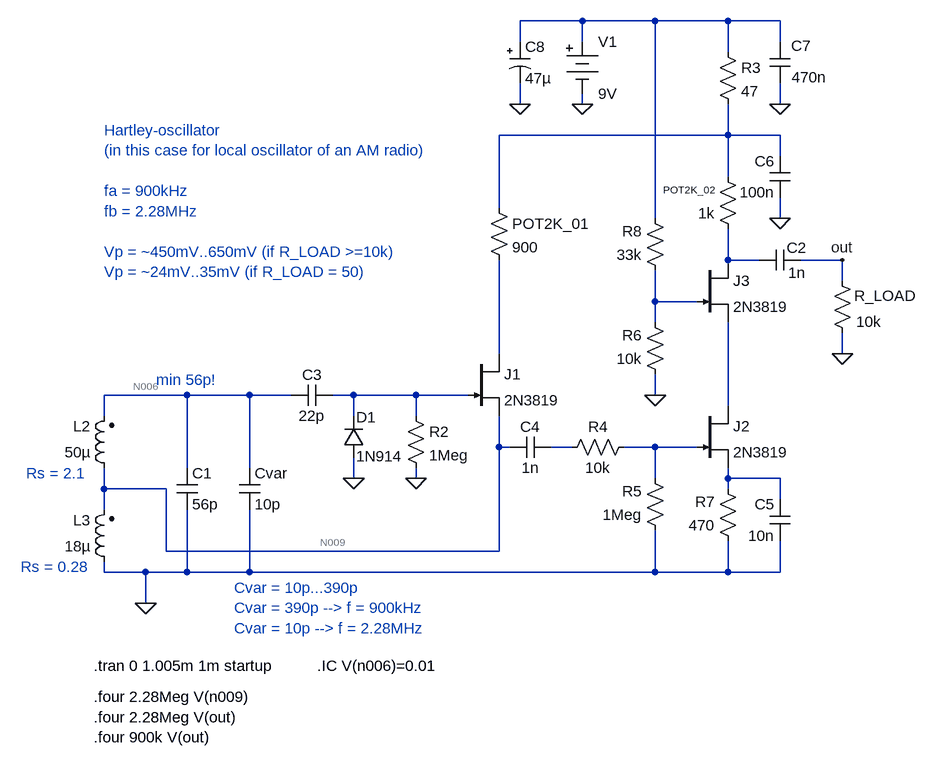
[diagram p0: schematic hartley-oscillator.asc]
hartley-oscillator.asc, the LTspice schematic file:
Version 4.1
SHEET 1 3080 944
WIRE 304 -224 208 -224
WIRE 416 -224 304 -224
WIRE 528 -224 416 -224
WIRE 608 -224 528 -224
WIRE 208 -192 208 -224
WIRE 304 -192 304 -224
WIRE 608 -192 608 -224
WIRE 528 -176 528 -224
WIRE 208 -96 208 -128
WIRE 304 -96 304 -112
WIRE 608 -96 608 -128
WIRE 528 -48 528 -96
WIRE 528 -48 176 -48
WIRE 608 -48 528 -48
WIRE 608 -16 608 -48
WIRE 528 16 528 -48
WIRE 176 64 176 -48
WIRE 416 80 416 -224
WIRE 608 80 608 48
WIRE 528 144 528 96
WIRE 576 144 528 144
WIRE 704 144 640 144
WIRE 704 176 704 144
WIRE 416 208 416 160
WIRE 480 208 416 208
WIRE 416 240 416 208
WIRE 176 288 176 144
WIRE 704 288 704 256
WIRE -304 352 -432 352
WIRE -208 352 -304 352
WIRE -144 352 -208 352
WIRE -48 352 -80 352
WIRE 48 352 -48 352
WIRE 128 352 48 352
WIRE 416 352 416 320
WIRE 528 368 528 240
WIRE -432 384 -432 352
WIRE -48 384 -48 352
WIRE 48 384 48 352
WIRE 176 432 176 384
WIRE 192 432 176 432
WIRE 288 432 256 432
WIRE 416 432 368 432
WIRE 480 432 416 432
WIRE -304 464 -304 352
WIRE -208 464 -208 352
WIRE -48 480 -48 448
WIRE 48 480 48 464
WIRE 416 480 416 432
WIRE 528 480 528 464
WIRE 608 480 528 480
WIRE -432 496 -432 464
WIRE -336 496 -432 496
WIRE 528 496 528 480
WIRE 608 512 608 480
WIRE -432 528 -432 496
WIRE -336 592 -336 496
WIRE 176 592 176 432
WIRE 176 592 -336 592
WIRE -432 624 -432 608
WIRE -368 624 -432 624
WIRE -304 624 -304 528
WIRE -304 624 -368 624
WIRE -208 624 -208 528
WIRE -208 624 -304 624
WIRE 416 624 416 560
WIRE 416 624 -208 624
WIRE 528 624 528 576
WIRE 528 624 416 624
WIRE 608 624 608 576
WIRE 608 624 528 624
WIRE -368 672 -368 624
FLAG -368 672 0
FLAG -48 480 0
FLAG 48 480 0
FLAG 304 -96 0
FLAG 704 144 out
FLAG 416 352 0
FLAG 704 288 0
FLAG 608 80 0
FLAG 208 -96 0
FLAG 608 -96 0
SYMBOL njf 128 288 R0
SYMATTR InstName J1
SYMATTR Value 2N3819
SYMBOL cap -320 464 R0
SYMATTR InstName C1
SYMATTR Value 56p
SYMBOL ind2 -416 480 R180
WINDOW 0 36 80 Left 2
WINDOW 3 36 40 Left 2
SYMATTR InstName L2
SYMATTR Value 50µ
SYMATTR SpiceLine Rser=2.1
SYMBOL ind2 -416 624 R180
WINDOW 0 36 80 Left 2
WINDOW 3 36 40 Left 2
SYMATTR InstName L3
SYMATTR Value 18µ
SYMATTR SpiceLine Rser=0.28
SYMBOL cap -80 336 R90
WINDOW 0 0 32 VBottom 2
WINDOW 3 32 32 VTop 2
SYMATTR InstName C3
SYMATTR Value 22p
SYMBOL res 160 48 R0
SYMATTR InstName POT2K_01
SYMATTR Value 900
SYMBOL res 32 368 R0
SYMATTR InstName R2
SYMATTR Value 1Meg
SYMBOL Misc\\battery 304 -208 R0
WINDOW 123 0 0 Left 0
WINDOW 39 0 0 Left 0
SYMATTR InstName V1
SYMATTR Value 9V
SYMBOL cap 256 416 R90
WINDOW 0 0 32 VBottom 2
WINDOW 3 32 32 VTop 2
SYMATTR InstName C4
SYMATTR Value 1n
SYMBOL res 432 576 R180
WINDOW 0 36 76 Left 2
WINDOW 3 36 40 Left 2
SYMATTR InstName R5
SYMATTR Value 1Meg
SYMBOL njf 480 368 R0
SYMATTR InstName J2
SYMATTR Value 2N3819
SYMBOL njf 480 144 R0
SYMATTR InstName J3
SYMATTR Value 2N3819
SYMBOL res 544 592 R180
WINDOW 0 36 76 Left 2
WINDOW 3 36 40 Left 2
SYMATTR InstName R7
SYMATTR Value 470
SYMBOL cap 640 128 R90
WINDOW 0 13 6 VBottom 2
WINDOW 3 20 6 VTop 2
SYMATTR InstName C2
SYMATTR Value 1n
SYMBOL cap 624 576 R180
WINDOW 0 24 56 Left 2
WINDOW 3 24 8 Left 2
SYMATTR InstName C5
SYMATTR Value 10n
SYMBOL res 432 336 R180
WINDOW 0 36 76 Left 2
WINDOW 3 36 40 Left 2
SYMATTR InstName R6
SYMATTR Value 10k
SYMBOL res 544 112 R180
WINDOW 0 36 76 Left 1
WINDOW 3 36 40 Left 2
SYMATTR InstName POT2K_02
SYMATTR Value 1k
SYMBOL res 720 272 R180
WINDOW 0 -98 73 Left 2
WINDOW 3 -44 33 Left 2
SYMATTR InstName R_LOAD
SYMATTR Value 10k
SYMBOL cap -224 464 R0
SYMATTR InstName Cvar
SYMATTR Value 10p
SYMBOL cap 624 48 R180
WINDOW 0 24 56 Left 2
WINDOW 3 24 8 Left 2
SYMATTR InstName C6
SYMATTR Value 100n
SYMBOL res 272 448 R270
WINDOW 0 32 56 VTop 2
WINDOW 3 0 56 VBottom 2
SYMATTR InstName R4
SYMATTR Value 10k
SYMBOL polcap 192 -192 R0
SYMATTR InstName C8
SYMATTR Value 47µ
SYMATTR SpiceLine V=25
SYMBOL res 432 176 R180
WINDOW 0 36 76 Left 2
WINDOW 3 36 40 Left 2
SYMATTR InstName R8
SYMATTR Value 33k
SYMBOL res 512 -192 R0
SYMATTR InstName R3
SYMATTR Value 47
SYMBOL cap 624 -128 R180
WINDOW 0 -32 58 Left 2
WINDOW 3 -56 9 Left 2
SYMATTR InstName C7
SYMATTR Value 470n
SYMBOL diode -32 448 R180
WINDOW 0 -19 62 Left 2
WINDOW 3 -59 2 Left 2
SYMATTR InstName D1
SYMATTR Value 1N914
TEXT -448 768 Left 2 !.tran 0 1.005m 1m startup
TEXT -448 816 Left 2 !.four 2.28Meg V(n009)\n.four 2.28Meg V(out)\n.four 900k V(out)
TEXT -352 328 Left 2 ;min 56p!
TEXT -232 648 Left 2 ;Cvar = 10p...390p\nCvar = 390p --> f = 900kHz\nCvar = 10p --> f = 2.28MHz
TEXT -432 -56 Left 2 ;Hartley-oscillator\n(in this case for local oscillator of an AM radio)\n \nfa = 900kHz\nfb = 2.28MHz\n \nVp = ~450mV..650mV (if R_LOAD >=10k)\nVp = ~24mV..35mV (if R_LOAD = 50)
TEXT -104 768 Left 2 !.IC V(n006)=0.01
TEXT -552 472 Left 2 ;Rs = 2.1
TEXT -560 616 Left 2 ;Rs = 0.28

The netlist it stands for:
* hartley-oscillator.asc
J1 N005 N007 N009 2N3819
C1 N006 0 56p
L2 N009 N006 50µ Rser=2.1
L3 0 N009 18µ Rser=0.28
C3 N007 N006 22p
R§POT2K_01 N002 N005 900
R2 N007 0 1Meg
V1 N001 0 9V
C4 N010 N009 1n
R5 0 N011 1Meg
J2 N008 N011 N012 2N3819
J3 N003 N004 N008 2N3819
R7 0 N012 470
C2 out N003 1n
C5 0 N012 10n
R6 0 N004 10k
R§POT2K_02 N003 N002 1k
R_LOAD 0 out 10k
Cvar N006 0 10p
C6 0 N002 100n
R4 N010 N011 10k
C8 N001 0 47µ V=25
R8 N004 N001 33k
R3 N001 N002 47
C7 0 N001 470n
D1 0 N007 1N914
.model D D
.lib standard.dio
.model NJF NJF
.model PJF PJF
.lib standard.jft
.tran 0 1.005m 1m startup
.four 2.28Meg V(n009)
.four 2.28Meg V(out)
.four 900k V(out)
* min 56p!
* Cvar = 10p...390p
* Cvar = 390p --> f = 900kHz
* Cvar = 10p --> f = 2.28MHz
* Hartley-oscillator
* (in this case for local oscillator of an AM radio)
* fa = 900kHz
* fb = 2.28MHz
* Vp = ~450mV..650mV (if R_LOAD >=10k)
* Vp = ~24mV..35mV (if R_LOAD = 50)
.IC V(n006)=0.01
* Rs = 2.1
* Rs = 0.28
.backanno
.end